# EAGLE design PowerPrototype (EAGLE 6.5.0)
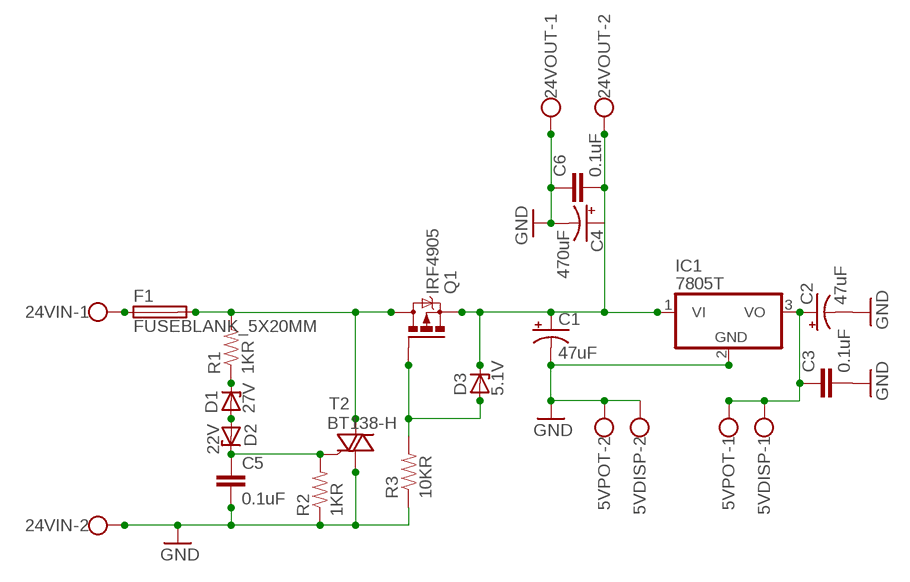
[diagram p0: schematic, sheet 1]

## Parts
5VDISP  W237-102  [W237-102]
5VPOT  W237-102  [W237-102]
24VIN  W237-102  [W237-102]
24VOUT  W237-102  [W237-102]
C1  47uF  CPOL-USE2.5-5  [E2,5-5]
C2  47uF  CPOL-USE2.5-5  [E2,5-5]
C3  0.1uF  CAPPTH1  [CAP-PTH-5MM]
C4  470uF  CPOL-USE2.5-5  [E2,5-5]
C5  0.1uF  CAPPTH1  [CAP-PTH-5MM]
C6  0.1uF  CAPPTH1  [CAP-PTH-5MM]
D1  27V  ZENER-DIODEZD-5  [ZDIO-5]
D2  22V  ZENER-DIODEZD-5  [ZDIO-5]
D3  5.1V  ZENER-DIODEZD-7.5  [ZDIO-7.5]
F1  FUSEBLANK_5X20MM  [FUSE_HOLDER_5X20MM]
IC1  7805T  [TO220H]
Q1  IRF4905  [TO220BH]
R1  1KR  RESISTORAXIAL-0.3  [AXIAL-0.3]
R2  1KR  RESISTORAXIAL-0.3  [AXIAL-0.3]
R3  10KR  RESISTORAXIAL-0.3  [AXIAL-0.3]
T2  BT138-H  [TO220BH]

## Nets
GND: 5VDISP.2 5VPOT.2 24VIN.2 24VOUT.1 C1.- C2.- C3.2 C4.- C5.2 C6.1 IC1.2(GND) R2.P$1 R3.P$1 T2.T1(A1)
N$1: 24VOUT.2 C1.+ C4.+ C6.2 D3.C IC1.1(VI) Q1.S
N$2: F1.2 Q1.D R1.P$2 T2.T2(A2)
N$3: 24VIN.1 F1.1
N$4: D3.A Q1.G R3.P$2
N$5: D1.C R1.P$1
N$6: D1.A D2.A
N$7: C5.1 D2.C R2.P$2 T2.G
N$9: 5VDISP.1 5VPOT.1 C2.+ C3.1 IC1.3(VO)

## Library data of the parts
5VDISP 5VPOT 24VIN 24VOUT = con-wago-500:W237-102: WAGO SCREW CLAMP; MPN: 237-102; OC_FARNELL: unknown; OC_NEWARK: 70K9898
C1 C2 C4 = adafruit:CPOL-US: POLARIZED CAPACITOR, American symbol
C3 C5 C6 = SparkFun-Capacitors:CAP: Capacitor Standard 0603 ceramic capacitor, and 0.1" leaded capacitor.
D1-D3 = diode:ZENER-DIODE: Z-Diode
F1 = fuse:FUSE: Fuse; OC_FARNELL: unknown; OC_NEWARK: unknown
IC1 = adafruit:78*: Positive VOLTAGE REGULATOR Added bigger pads to the TO-92 package
Q1 = transistor-power:IRF4905: P-Channel HEXFET® Power MOSFET RDS(on)= 0.02 Ohm, ID = -74A Source: http://www.irf.com/product-info/datasheets/data/irf4905pbf.pdf
R1-R3 = SparkFun-Resistors:RESISTOR: Resistor Basic schematic elements and footprints for 0603, 1206, and PTH resistors.
T2 = triac:BT138: TRIAC Source: http://www.semiconductors.philips.com BT138_SERIES_2.pdf

## Net classes
1 power: width 0.381 mm

## Board
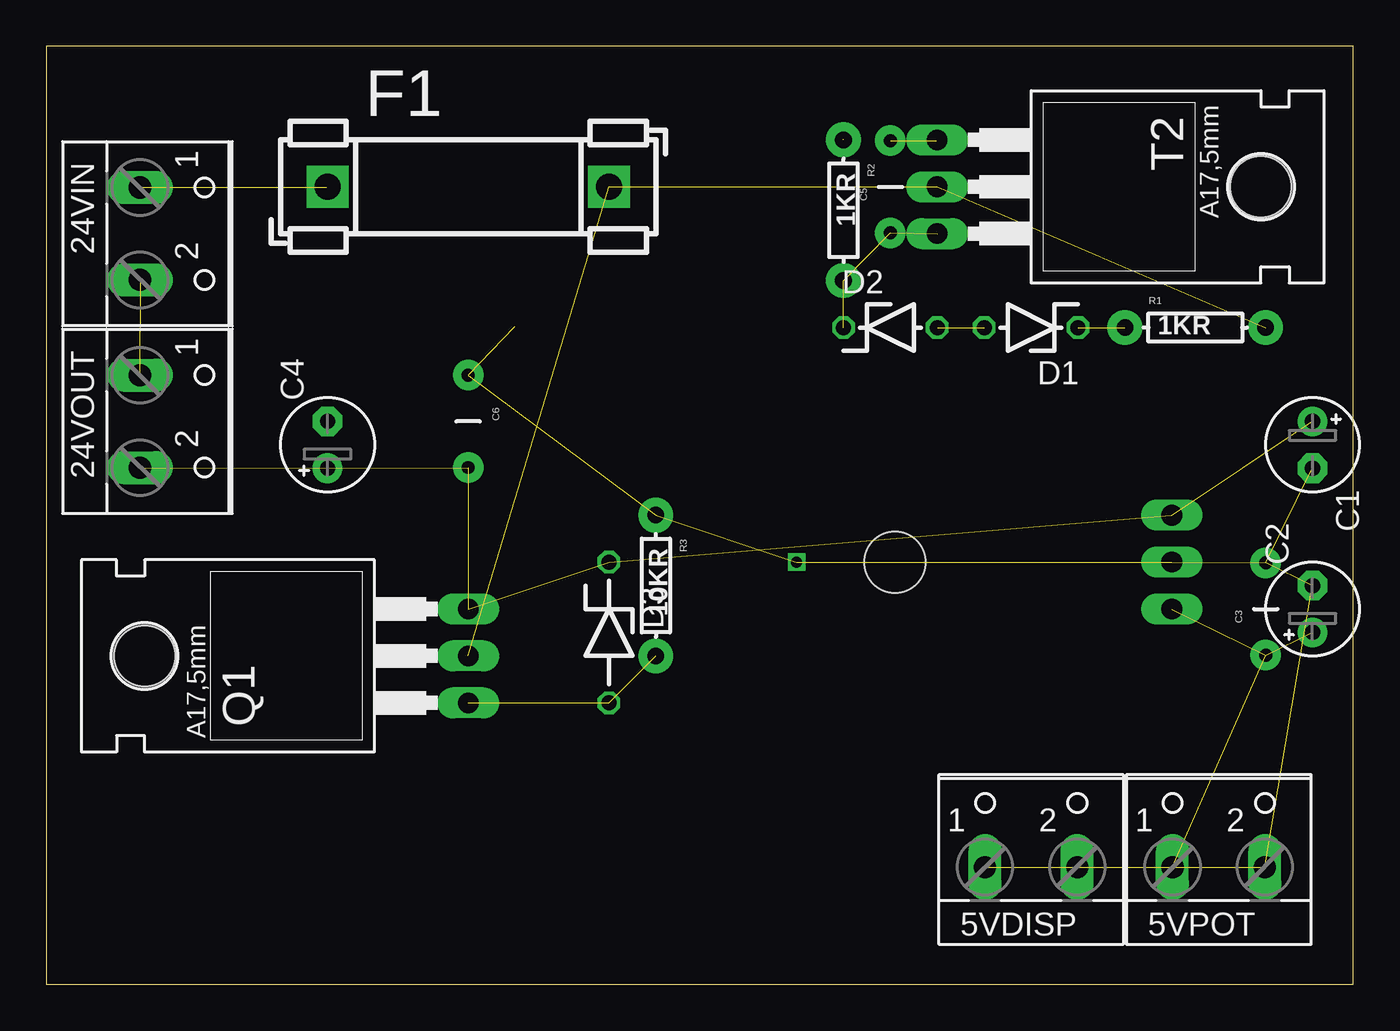
[diagram p1: board, top side]
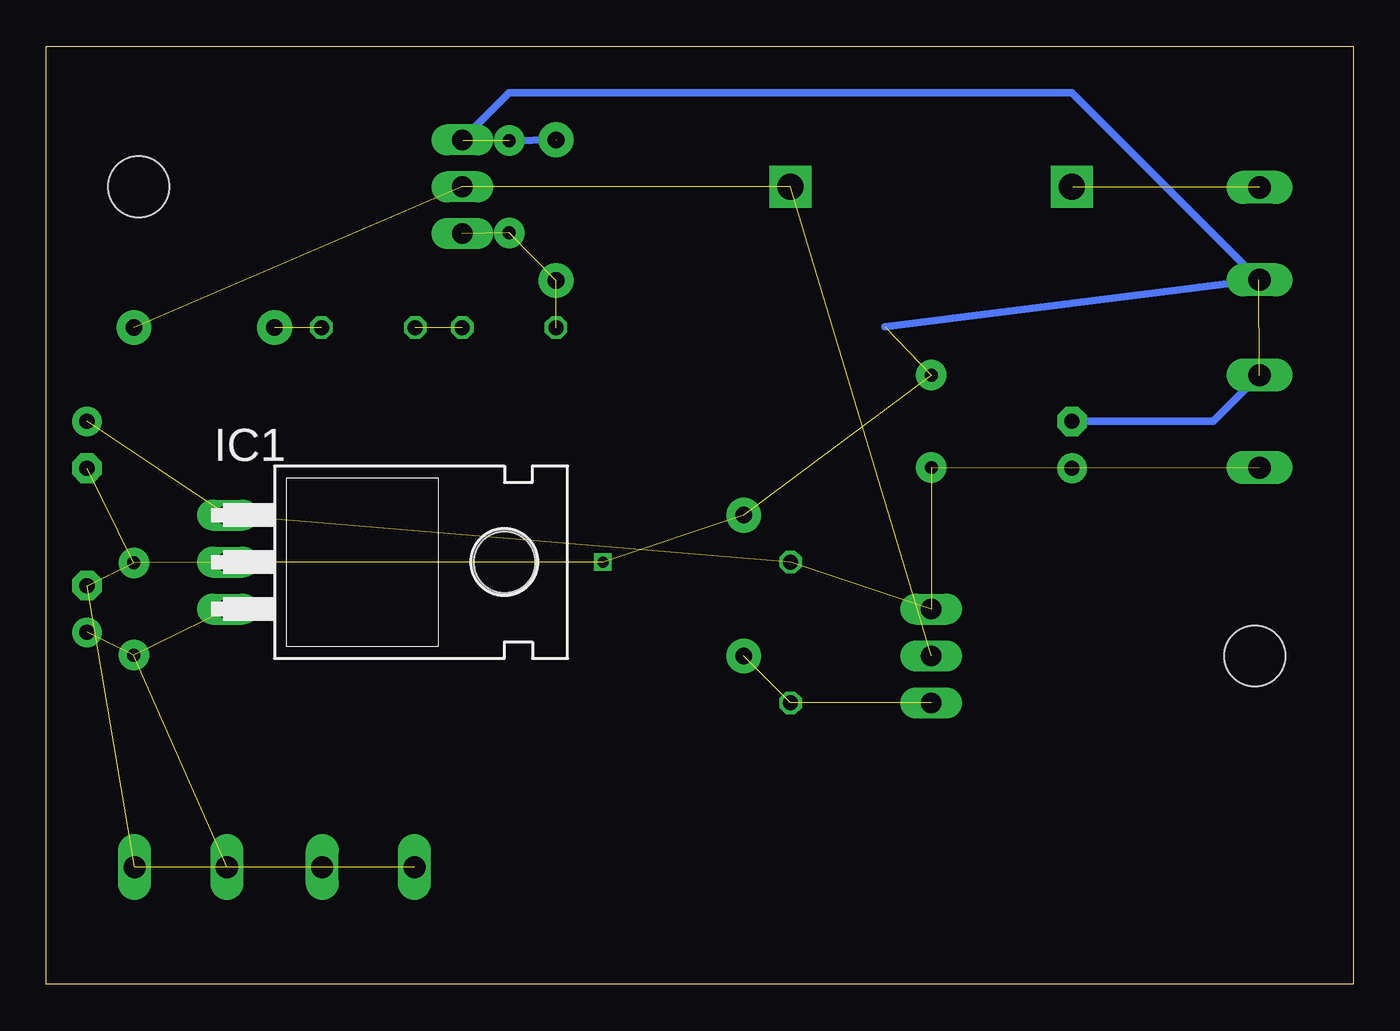
[diagram p2: board, bottom side, seen from below]

Size 70.79 x 50.79 mm. Coordinates in mm from the lower left corner, seen from the top.
Outline: 0,0 70.79,0 70.79,50.79 0,50.79 0,0
Copper layers (1*16): Top 0.0356mm / dielectric 1.5011mm / Bottom 0.0356mm
Design rules "DesignRules": minimum track width 10mil, minimum drill 13mil, track to track 6mil, track to pad 6mil, pad to pad 6mil, via to via 6mil, smd to smd 6mil, copper to edge 15mil, drill to drill 6mil, minimum pad ring 7mil, minimum via ring 7mil, stop-mask expansion 3mil, vias tented up to drill 0mil, thermal gap 10mil

### Footprints (pad centres in the part's own frame; a part is rotated, then mirrored left to right if it is on the bottom)
W237-102 = drill 1.194 long: 1 -2.5,-1.27; 2 2.5,-1.27
E2,5-5 = drill 0.813 pad 1.6: + -1.27,0 | drill 0.813 pad 1.6 octagon: - 1.27,0
CAP-PTH-5MM = drill 0.7 pad 1.651: 1 -2.5,0; 2 2.5,0
ZDIO-5 = drill 0.813 octagon: A 2.54,0; C -2.54,0
ZDIO-7.5 = drill 0.813 octagon: A 3.81,0; C -3.81,0
FUSE_HOLDER_5X20MM = drill 1.422 pad 2.286 square: 1 0,0; 2 15.24,0
TO220H = drill 1.118 long: 1 -2.54,-10.16; 2 0,-10.16; 3 2.54,-10.16 | hole 3.302: 0,4.826
TO220BH = drill 1.118 long: D 0,-6.35; G -2.54,-6.35; S 2.54,-6.35 | hole 3.302: 0,11.176
AXIAL-0.3 = drill 0.9 pad 1.88: P$1 -3.81,0; P$2 3.81,0
TO220BH' = drill 1.118 long: G 2.54,-6.35; T1 -2.54,-6.35; T2 0,-6.35 | hole 3.302: 0,11.176

### Placement (x,y rotation side)
5VDISP  53.34,7.62 0 top
5VPOT  63.5,7.62 0 top
24VIN  6.35,40.64 270 top
24VOUT  6.35,30.48 270 top
C1  68.58,29.21 270 top
C2  68.58,20.32 90 top
C3  66.04,20.32 90 top
C4  15.24,29.21 90 top
C5  45.72,43.18 90 top
C6  22.86,30.48 270 top
D1  53.34,35.56 180 top
D2  45.72,35.56 0 top
D3  30.48,19.05 270 top
F1  15.24,43.18 0 top
IC1  50.8,22.86 270 bottom
Q1  16.51,17.78 90 top
R1  62.23,35.56 0 top
R2  43.18,41.91 270 top
R3  33.02,21.59 270 top
T2  BT138-H  [TO220BH']  54.61,43.18 270 top

### Tracks (layer width: path | path; a pad name or v marks a point on that pad's centre or on a via)
GND  (via drill 0.6)  (12 unrouted)
  Bottom 0.406: 43.14,45.72 C5.2 | 48.22,45.68 T2.T1 45.72,48.26 15.24,48.26 5.12,38.14 24VIN.2 25.36,35.6 | C4.- 7.58,30.48 24VOUT.1
  other vias: 40.64,22.86
N$1  (6 unrouted)
N$2  (3 unrouted)
N$3  (1 unrouted)
  Bottom 0.406: 15.2,43.14 F1.1
N$4  (2 unrouted)
N$5  (1 unrouted)
N$6  (1 unrouted)
N$7  (3 unrouted)
N$9  (4 unrouted)